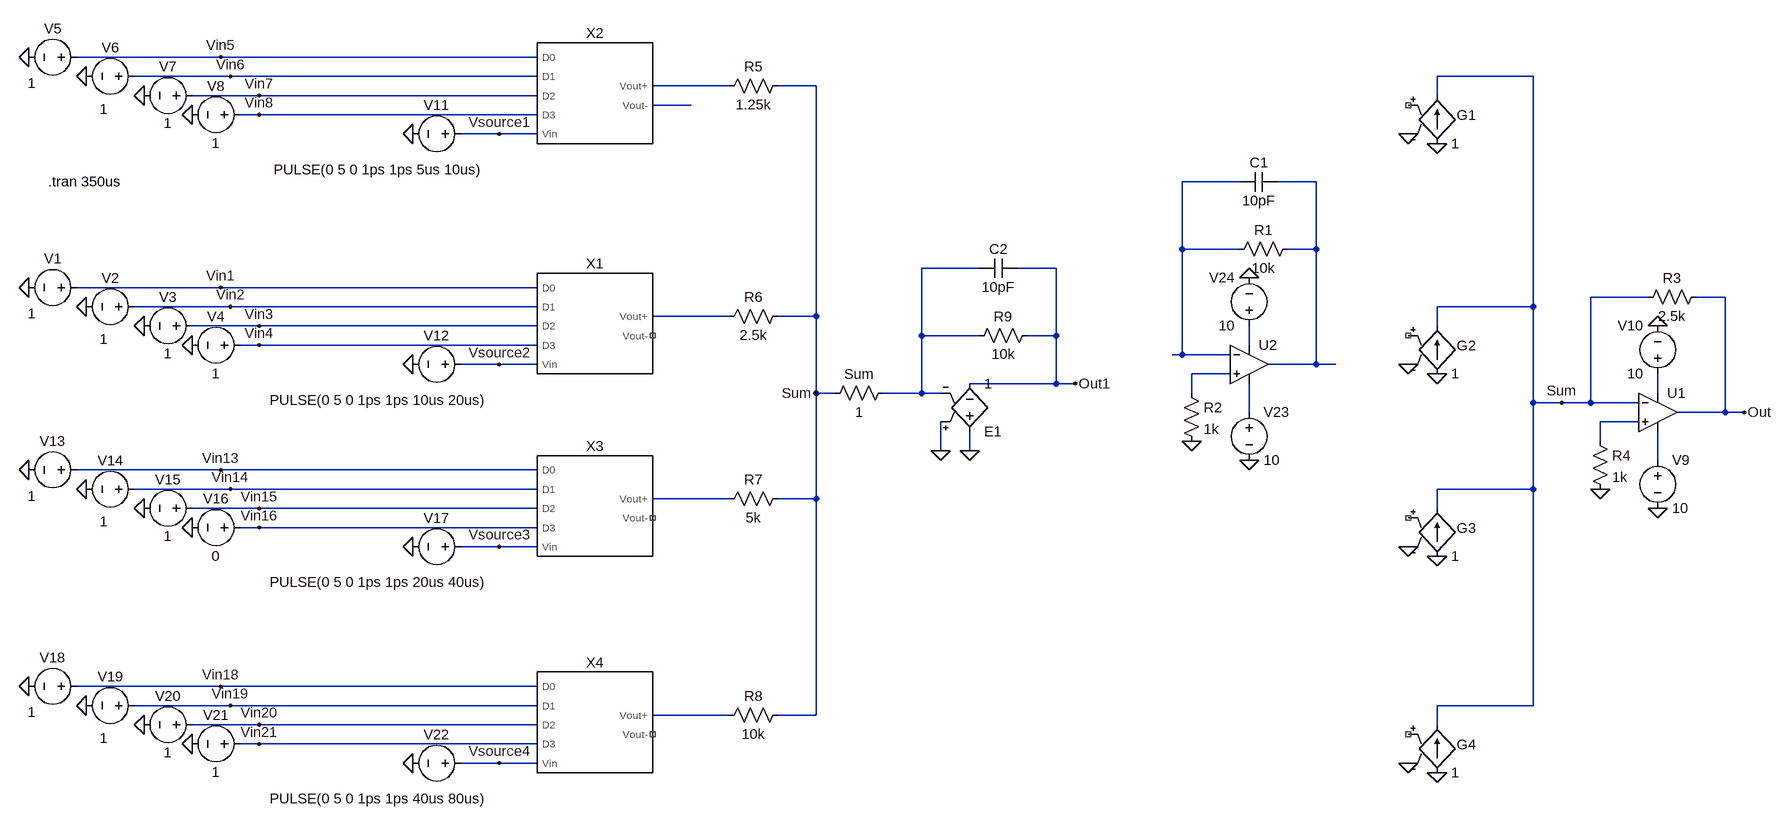
[diagram p0: schematic PerceptronV1.asc]
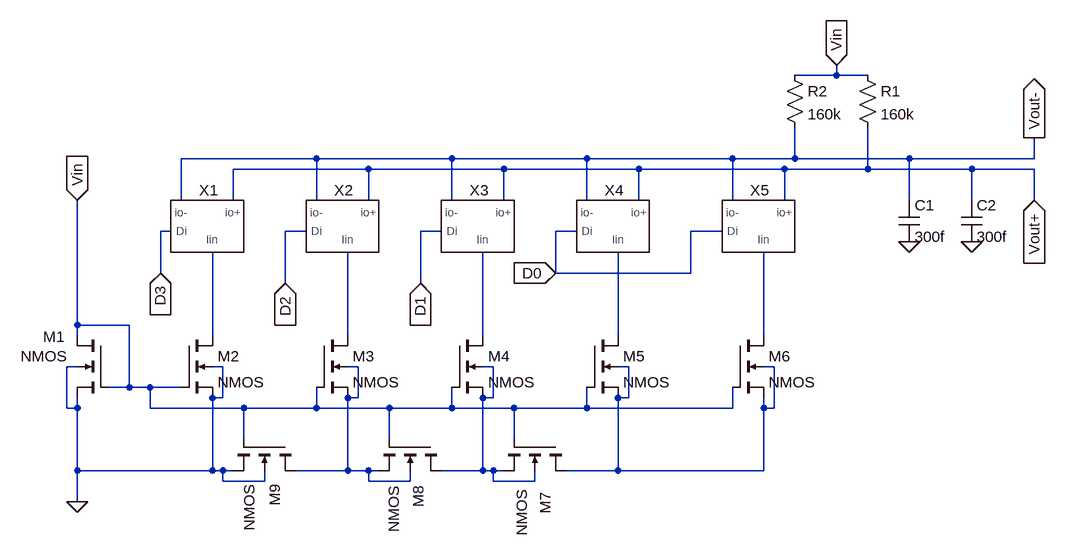
[diagram p1: sub-circuit 4_bit_dacv1.asc]
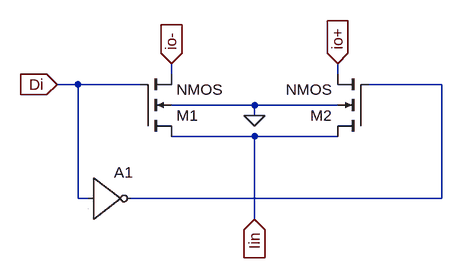
[diagram p2: sub-circuit differentialinput.asc]
PerceptronV1.asc, the LTspice schematic file:
Version 4
SHEET 1 3164 1116
WIRE -720 -160 -960 -160
WIRE -192 -160 -720 -160
WIRE -704 -128 -864 -128
WIRE -192 -128 -704 -128
WIRE 2752 -128 2592 -128
WIRE 128 -112 0 -112
WIRE 272 -112 208 -112
WIRE -656 -96 -768 -96
WIRE -192 -96 -656 -96
WIRE 2592 -96 2592 -128
WIRE 64 -80 0 -80
WIRE -656 -64 -688 -64
WIRE -192 -64 -656 -64
WIRE -256 -32 -320 -32
WIRE -192 -32 -256 -32
WIRE 1808 48 1712 48
WIRE 1936 48 1872 48
WIRE 1712 160 1712 48
WIRE 1808 160 1712 160
WIRE 1936 160 1936 48
WIRE 1936 160 1888 160
WIRE 544 192 448 192
WIRE 672 192 608 192
WIRE -720 224 -960 224
WIRE -192 224 -720 224
WIRE 2944 240 2848 240
WIRE 3072 240 3024 240
WIRE -704 256 -864 256
WIRE -192 256 -704 256
WIRE 2752 256 2752 -128
WIRE 2752 256 2592 256
WIRE 128 272 0 272
WIRE 272 272 272 -112
WIRE 272 272 208 272
WIRE -656 288 -768 288
WIRE -192 288 -656 288
WIRE 2592 288 2592 256
WIRE 448 304 448 192
WIRE 544 304 448 304
WIRE 672 304 672 192
WIRE 672 304 624 304
WIRE -656 320 -688 320
WIRE -192 320 -656 320
WIRE 1824 320 1824 288
WIRE 1712 336 1712 160
WIRE 1712 336 1696 336
WIRE 1792 336 1712 336
WIRE -256 352 -320 352
WIRE -192 352 -256 352
WIRE 1936 352 1936 160
WIRE 1936 352 1856 352
WIRE 1968 352 1936 352
WIRE 1792 368 1728 368
WIRE 672 384 672 304
WIRE 672 384 528 384
WIRE 704 384 672 384
WIRE 272 400 272 272
WIRE 304 400 272 400
WIRE 448 400 448 304
WIRE 448 400 384 400
WIRE 480 400 448 400
WIRE 1728 400 1728 368
WIRE 2960 400 2960 368
WIRE 2752 416 2752 256
WIRE 2800 416 2752 416
WIRE 2848 416 2848 240
WIRE 2848 416 2800 416
WIRE 2928 416 2848 416
WIRE 1824 432 1824 384
WIRE 3072 432 3072 240
WIRE 3072 432 2992 432
WIRE 3104 432 3072 432
WIRE 2928 448 2864 448
WIRE 2864 480 2864 448
WIRE 480 496 480 448
WIRE 528 496 528 464
WIRE 2960 512 2960 464
WIRE -720 528 -960 528
WIRE -192 528 -720 528
WIRE -704 560 -864 560
WIRE -192 560 -704 560
WIRE 2752 560 2752 416
WIRE 2752 560 2592 560
WIRE 128 576 0 576
WIRE 272 576 272 400
WIRE 272 576 208 576
WIRE -656 592 -768 592
WIRE -192 592 -656 592
WIRE 2592 592 2592 560
WIRE -656 624 -688 624
WIRE -192 624 -656 624
WIRE -256 656 -320 656
WIRE -192 656 -256 656
WIRE -720 912 -960 912
WIRE -192 912 -720 912
WIRE -704 944 -864 944
WIRE -192 944 -704 944
WIRE 2752 944 2752 560
WIRE 2752 944 2592 944
WIRE 128 960 0 960
WIRE 272 960 272 576
WIRE 272 960 208 960
WIRE -656 976 -768 976
WIRE -192 976 -656 976
WIRE 2592 976 2592 944
WIRE -656 1008 -688 1008
WIRE -192 1008 -656 1008
WIRE -256 1040 -320 1040
WIRE -192 1040 -256 1040
FLAG 2592 -16 0
FLAG 2544 -32 0
FLAG 2960 592 0
FLAG 2960 288 0
FLAG 2864 560 0
FLAG 2800 416 Sum
FLAG 3104 432 Out
FLAG -768 -64 0
FLAG -848 -96 0
FLAG -944 -128 0
FLAG -1040 -160 0
FLAG -720 -160 Vin5
FLAG -704 -128 Vin6
FLAG -656 -96 Vin7
FLAG -656 -64 Vin8
FLAG -400 -32 0
FLAG 2592 368 0
FLAG 2544 352 0
FLAG -768 320 0
FLAG -848 288 0
FLAG -944 256 0
FLAG -1040 224 0
FLAG -720 224 Vin1
FLAG -704 256 Vin2
FLAG -656 288 Vin3
FLAG -656 320 Vin4
FLAG -400 352 0
FLAG 2592 672 0
FLAG 2544 656 0
FLAG -768 624 0
FLAG -848 592 0
FLAG -944 560 0
FLAG -1040 528 0
FLAG -720 528 Vin13
FLAG -704 560 Vin14
FLAG -656 592 Vin15
FLAG -656 624 Vin16
FLAG -400 656 0
FLAG 2592 1056 0
FLAG 2544 1040 0
FLAG -768 1008 0
FLAG -848 976 0
FLAG -944 944 0
FLAG -1040 912 0
FLAG -720 912 Vin18
FLAG -704 944 Vin19
FLAG -656 976 Vin20
FLAG -656 1008 Vin21
FLAG -400 1040 0
FLAG 1824 512 0
FLAG 1824 208 0
FLAG 1728 480 0
FLAG 272 400 Sum
FLAG 704 384 Out1
FLAG -256 656 Vsource3
FLAG -256 -32 Vsource1
FLAG -256 352 Vsource2
FLAG -256 1040 Vsource4
FLAG 480 496 0
FLAG 528 496 0
SYMBOL g 2592 -112 R0
WINDOW 0 33 49 Left 2
SYMATTR InstName G1
SYMATTR Value 1
SYMBOL res 2928 256 R270
WINDOW 0 32 56 VTop 2
WINDOW 3 0 56 VBottom 2
SYMATTR InstName R3
SYMATTR Value 2.5k
SYMBOL voltage 2960 496 R0
WINDOW 123 0 0 Left 0
WINDOW 39 0 0 Left 0
SYMATTR InstName V9
SYMATTR Value 10
SYMBOL voltage 2960 384 R180
WINDOW 0 24 96 Left 2
WINDOW 3 24 16 Left 2
WINDOW 123 0 0 Left 0
WINDOW 39 0 0 Left 0
SYMATTR InstName V10
SYMATTR Value 10
SYMBOL res 2848 464 R0
SYMATTR InstName R4
SYMATTR Value 1k
SYMBOL OpAmps\\UniversalOpAmp 2960 432 R0
SYMATTR InstName U1
SYMBOL 4_Bit_DACV1 -96 -80 R0
SYMATTR InstName X2
SYMBOL voltage -944 -160 R90
WINDOW 0 -32 56 VBottom 2
WINDOW 3 28 91 VTop 2
WINDOW 123 0 0 Left 0
WINDOW 39 0 0 Left 0
SYMATTR InstName V5
SYMATTR Value 1
SYMBOL voltage -848 -128 R90
WINDOW 0 -32 56 VBottom 2
WINDOW 3 39 67 VTop 2
WINDOW 123 0 0 Left 0
WINDOW 39 0 0 Left 0
SYMATTR InstName V6
SYMATTR Value 1
SYMBOL voltage -752 -96 R90
WINDOW 0 -32 56 VBottom 2
WINDOW 3 62 56 VBottom 2
WINDOW 123 0 0 Left 0
WINDOW 39 0 0 Left 0
SYMATTR InstName V7
SYMATTR Value 1
SYMBOL voltage -672 -64 R90
WINDOW 0 -32 56 VBottom 2
WINDOW 3 32 56 VTop 2
WINDOW 123 0 0 Left 0
WINDOW 39 0 0 Left 0
SYMATTR InstName V8
SYMATTR Value 1
SYMBOL voltage -304 -32 R90
WINDOW 0 -32 56 VBottom 2
WINDOW 3 44 155 VTop 2
WINDOW 123 0 0 Left 0
WINDOW 39 0 0 Left 0
SYMATTR InstName V11
SYMATTR Value PULSE(0 5 0 1ps 1ps 5us 10us)
SYMBOL g 2592 272 R0
WINDOW 0 33 49 Left 2
SYMATTR InstName G2
SYMATTR Value 1
SYMBOL 4_Bit_DACV1 -96 304 R0
SYMATTR InstName X1
SYMBOL voltage -944 224 R90
WINDOW 0 -32 56 VBottom 2
WINDOW 3 28 91 VTop 2
WINDOW 123 0 0 Left 0
WINDOW 39 0 0 Left 0
SYMATTR InstName V1
SYMATTR Value 1
SYMBOL voltage -848 256 R90
WINDOW 0 -32 56 VBottom 2
WINDOW 3 39 67 VTop 2
WINDOW 123 0 0 Left 0
WINDOW 39 0 0 Left 0
SYMATTR InstName V2
SYMATTR Value 1
SYMBOL voltage -752 288 R90
WINDOW 0 -32 56 VBottom 2
WINDOW 3 62 56 VBottom 2
WINDOW 123 0 0 Left 0
WINDOW 39 0 0 Left 0
SYMATTR InstName V3
SYMATTR Value 1
SYMBOL voltage -672 320 R90
WINDOW 0 -32 56 VBottom 2
WINDOW 3 32 56 VTop 2
WINDOW 123 0 0 Left 0
WINDOW 39 0 0 Left 0
SYMATTR InstName V4
SYMATTR Value 1
SYMBOL voltage -304 352 R90
WINDOW 0 -32 56 VBottom 2
WINDOW 3 44 155 VTop 2
WINDOW 123 0 0 Left 0
WINDOW 39 0 0 Left 0
SYMATTR InstName V12
SYMATTR Value PULSE(0 5 0 1ps 1ps 10us 20us)
SYMBOL g 2592 576 R0
WINDOW 0 33 49 Left 2
SYMATTR InstName G3
SYMATTR Value 1
SYMBOL 4_Bit_DACV1 -96 608 R0
SYMATTR InstName X3
SYMBOL voltage -944 528 R90
WINDOW 0 -32 56 VBottom 2
WINDOW 3 28 91 VTop 2
WINDOW 123 0 0 Left 0
WINDOW 39 0 0 Left 0
SYMATTR InstName V13
SYMATTR Value 1
SYMBOL voltage -848 560 R90
WINDOW 0 -32 56 VBottom 2
WINDOW 3 39 67 VTop 2
WINDOW 123 0 0 Left 0
WINDOW 39 0 0 Left 0
SYMATTR InstName V14
SYMATTR Value 1
SYMBOL voltage -752 592 R90
WINDOW 0 -32 56 VBottom 2
WINDOW 3 62 56 VBottom 2
WINDOW 123 0 0 Left 0
WINDOW 39 0 0 Left 0
SYMATTR InstName V15
SYMATTR Value 1
SYMBOL voltage -672 624 R90
WINDOW 0 -32 56 VBottom 2
WINDOW 3 32 56 VTop 2
WINDOW 123 0 0 Left 0
WINDOW 39 0 0 Left 0
SYMATTR InstName V16
SYMATTR Value 0
SYMBOL voltage -304 656 R90
WINDOW 0 -32 56 VBottom 2
WINDOW 3 44 155 VTop 2
WINDOW 123 0 0 Left 0
WINDOW 39 0 0 Left 0
SYMATTR InstName V17
SYMATTR Value PULSE(0 5 0 1ps 1ps 20us 40us)
SYMBOL g 2592 960 R0
WINDOW 0 33 49 Left 2
SYMATTR InstName G4
SYMATTR Value 1
SYMBOL 4_Bit_DACV1 -96 992 R0
SYMATTR InstName X4
SYMBOL voltage -944 912 R90
WINDOW 0 -32 56 VBottom 2
WINDOW 3 28 91 VTop 2
WINDOW 123 0 0 Left 0
WINDOW 39 0 0 Left 0
SYMATTR InstName V18
SYMATTR Value 1
SYMBOL voltage -848 944 R90
WINDOW 0 -32 56 VBottom 2
WINDOW 3 39 67 VTop 2
WINDOW 123 0 0 Left 0
WINDOW 39 0 0 Left 0
SYMATTR InstName V19
SYMATTR Value 1
SYMBOL voltage -752 976 R90
WINDOW 0 -32 56 VBottom 2
WINDOW 3 62 56 VBottom 2
WINDOW 123 0 0 Left 0
WINDOW 39 0 0 Left 0
SYMATTR InstName V20
SYMATTR Value 1
SYMBOL voltage -672 1008 R90
WINDOW 0 -32 56 VBottom 2
WINDOW 3 32 56 VTop 2
WINDOW 123 0 0 Left 0
WINDOW 39 0 0 Left 0
SYMATTR InstName V21
SYMATTR Value 1
SYMBOL voltage -304 1040 R90
WINDOW 0 -32 56 VBottom 2
WINDOW 3 44 155 VTop 2
WINDOW 123 0 0 Left 0
WINDOW 39 0 0 Left 0
SYMATTR InstName V22
SYMATTR Value PULSE(0 5 0 1ps 1ps 40us 80us)
SYMBOL res 1792 176 R270
WINDOW 0 32 56 VTop 2
WINDOW 3 0 56 VBottom 2
SYMATTR InstName R1
SYMATTR Value 10k
SYMBOL voltage 1824 416 R0
WINDOW 123 0 0 Left 0
WINDOW 39 0 0 Left 0
SYMATTR InstName V23
SYMATTR Value 10
SYMBOL voltage 1824 304 R180
WINDOW 0 24 96 Left 2
WINDOW 3 24 16 Left 2
WINDOW 123 0 0 Left 0
WINDOW 39 0 0 Left 0
SYMATTR InstName V24
SYMATTR Value 10
SYMBOL res 1712 384 R0
SYMATTR InstName R2
SYMATTR Value 1k
SYMBOL OpAmps\\UniversalOpAmp 1824 352 R0
SYMATTR InstName U2
SYMBOL cap 1872 32 R90
WINDOW 0 0 32 VBottom 2
WINDOW 3 32 32 VTop 2
SYMATTR InstName C1
SYMATTR Value 10pF
SYMBOL res 224 -128 R90
WINDOW 0 0 56 VBottom 2
WINDOW 3 32 56 VTop 2
SYMATTR InstName R5
SYMATTR Value 1.25k
SYMBOL res 224 256 R90
WINDOW 0 0 56 VBottom 2
WINDOW 3 32 56 VTop 2
SYMATTR InstName R6
SYMATTR Value 2.5k
SYMBOL res 224 560 R90
WINDOW 0 0 56 VBottom 2
WINDOW 3 32 56 VTop 2
SYMATTR InstName R7
SYMATTR Value 5k
SYMBOL res 224 944 R90
WINDOW 0 0 56 VBottom 2
WINDOW 3 32 56 VTop 2
SYMATTR InstName R8
SYMATTR Value 10k
SYMBOL res 288 416 R270
WINDOW 0 32 56 VTop 2
WINDOW 3 0 56 VBottom 2
SYMATTR InstName Sum
SYMATTR Value 1
SYMBOL e 528 480 M180
SYMATTR InstName E1
SYMATTR Value 1
SYMBOL res 528 320 R270
WINDOW 0 32 56 VTop 2
WINDOW 3 0 56 VBottom 2
SYMATTR InstName R9
SYMATTR Value 10k
SYMBOL cap 608 176 R90
WINDOW 0 0 32 VBottom 2
WINDOW 3 32 32 VTop 2
SYMATTR InstName C2
SYMATTR Value 10pF
TEXT -1008 48 Left 2 !.tran 350us

4_bit_dacv1.asc, the sub-circuit schematic file:
Version 4
SHEET 1 1652 696
WIRE 1216 -80 1216 -96
WIRE 1216 -80 1152 -80
WIRE 1264 -80 1216 -80
WIRE 416 48 208 48
WIRE 624 48 416 48
WIRE 832 48 624 48
WIRE 1056 48 832 48
WIRE 1152 48 1152 0
WIRE 1152 48 1056 48
WIRE 1328 48 1152 48
WIRE 1520 48 1520 16
WIRE 1520 48 1328 48
WIRE 496 64 288 64
WIRE 704 64 496 64
WIRE 912 64 704 64
WIRE 1136 64 912 64
WIRE 1264 64 1264 0
WIRE 1264 64 1136 64
WIRE 1424 64 1264 64
WIRE 1520 64 1424 64
WIRE 208 112 208 48
WIRE 288 112 288 64
WIRE 416 112 416 48
WIRE 496 112 496 64
WIRE 624 112 624 48
WIRE 704 112 704 64
WIRE 832 112 832 48
WIRE 912 112 912 64
WIRE 1056 112 1056 48
WIRE 1136 112 1136 64
WIRE 1328 112 1328 48
WIRE 1424 112 1424 64
WIRE 1520 112 1520 64
WIRE 192 160 176 160
WIRE 400 160 368 160
WIRE 608 160 576 160
WIRE 816 160 784 160
WIRE 1040 160 992 160
WIRE 176 224 176 160
WIRE 784 224 784 160
WIRE 992 224 992 160
WIRE 992 224 784 224
WIRE 368 240 368 160
WIRE 576 240 576 160
WIRE 48 304 48 112
WIRE 128 304 48 304
WIRE 48 320 48 304
WIRE 256 320 256 192
WIRE 464 320 464 192
WIRE 672 320 672 192
WIRE 880 320 880 192
WIRE 1104 320 1104 192
WIRE 48 368 32 368
WIRE 272 368 256 368
WIRE 480 368 464 368
WIRE 688 368 672 368
WIRE 896 368 880 368
WIRE 1120 368 1104 368
WIRE 128 400 128 304
WIRE 128 400 96 400
WIRE 160 400 128 400
WIRE 208 400 160 400
WIRE 272 416 272 368
WIRE 272 416 256 416
WIRE 480 416 480 368
WIRE 480 416 464 416
WIRE 688 416 688 368
WIRE 688 416 672 416
WIRE 896 416 896 368
WIRE 896 416 880 416
WIRE 32 432 32 368
WIRE 48 432 48 416
WIRE 48 432 32 432
WIRE 160 432 160 400
WIRE 304 432 160 432
WIRE 416 432 416 400
WIRE 416 432 304 432
WIRE 528 432 416 432
WIRE 624 432 624 400
WIRE 624 432 528 432
WIRE 720 432 624 432
WIRE 832 432 832 400
WIRE 832 432 720 432
WIRE 1056 432 1056 400
WIRE 1056 432 832 432
WIRE 1104 432 1104 416
WIRE 1120 432 1120 368
WIRE 1120 432 1104 432
WIRE 304 480 304 432
WIRE 528 480 528 432
WIRE 720 480 720 432
WIRE 48 528 48 432
WIRE 256 528 256 416
WIRE 256 528 48 528
WIRE 272 528 256 528
WIRE 288 528 272 528
WIRE 464 528 464 416
WIRE 464 528 384 528
WIRE 496 528 464 528
WIRE 512 528 496 528
WIRE 672 528 672 416
WIRE 672 528 608 528
WIRE 688 528 672 528
WIRE 704 528 688 528
WIRE 880 528 880 416
WIRE 880 528 800 528
WIRE 1104 528 1104 432
WIRE 1104 528 880 528
WIRE 272 544 272 528
WIRE 336 544 336 528
WIRE 336 544 272 544
WIRE 496 544 496 528
WIRE 560 544 560 528
WIRE 560 544 496 544
WIRE 688 544 688 528
WIRE 752 544 752 528
WIRE 752 544 688 544
WIRE 48 576 48 528
FLAG 784 224 D0
IOPIN 784 224 In
FLAG 576 240 D1
IOPIN 576 240 In
FLAG 368 240 D2
IOPIN 368 240 In
FLAG 176 224 D3
IOPIN 176 224 In
FLAG 1328 176 0
FLAG 1424 176 0
FLAG 1520 16 Vout-
IOPIN 1520 16 Out
FLAG 1520 112 Vout+
IOPIN 1520 112 In
FLAG 48 576 0
FLAG 48 112 Vin
IOPIN 48 112 In
FLAG 1216 -96 Vin
IOPIN 1216 -96 In
SYMBOL nmos4 96 320 M0
WINDOW 0 67 2 Left 2
WINDOW 3 63 32 Left 2
SYMATTR InstName M1
SYMATTR Value2 l=45n w=250n
SYMBOL nmos4 208 320 R0
SYMATTR InstName M2
SYMATTR Value2 l=45n w=200n
SYMBOL nmos4 416 320 R0
SYMATTR InstName M3
SYMATTR Value2 l=45n w=350n
SYMBOL nmos4 624 320 R0
SYMATTR InstName M4
SYMATTR Value2 l=45n w=350n
SYMBOL nmos4 832 320 R0
SYMATTR InstName M5
SYMATTR Value2 l=45n w=350n
SYMBOL nmos4 1056 320 R0
SYMATTR InstName M6
SYMATTR Value2 l=45n w=350n
SYMBOL nmos4 800 480 R90
WINDOW 0 81 32 Left 2
WINDOW 3 77 68 Left 2
SYMATTR InstName M7
SYMATTR Value2 l=45n w=300n
SYMBOL nmos4 608 480 R90
WINDOW 0 71 35 Left 2
WINDOW 3 71 73 Left 2
SYMATTR InstName M8
SYMATTR Value2 l=45n w=300n
SYMBOL nmos4 384 480 R90
WINDOW 0 69 32 Left 2
WINDOW 3 69 71 Left 2
SYMATTR InstName M9
SYMATTR Value2 l=45n w=300n
SYMBOL DifferentialInput 224 176 R0
SYMATTR InstName X1
SYMBOL DifferentialInput 432 176 R0
SYMATTR InstName X2
SYMBOL DifferentialInput 640 176 R0
SYMATTR InstName X3
SYMBOL DifferentialInput 848 176 R0
SYMATTR InstName X4
SYMBOL DifferentialInput 1072 176 R0
SYMATTR InstName X5
SYMBOL cap 1312 112 R0
SYMATTR InstName C1
SYMATTR Value 300f
SYMBOL cap 1408 112 R0
SYMATTR InstName C2
SYMATTR Value 300f
SYMBOL res 1248 -96 R0
SYMATTR InstName R1
SYMATTR Value 160k
SYMBOL res 1136 -96 R0
SYMATTR InstName R2
SYMATTR Value 160k

differentialinput.asc, the sub-circuit schematic file:
Version 4
SHEET 1 880 680
WIRE 192 32 192 16
WIRE 448 32 448 16
WIRE 48 48 16 48
WIRE 144 48 48 48
WIRE 608 48 496 48
WIRE 320 80 192 80
WIRE 448 80 320 80
WIRE 320 96 320 80
WIRE 320 128 192 128
WIRE 448 128 320 128
WIRE 48 224 48 48
WIRE 64 224 48 224
WIRE 608 224 608 48
WIRE 608 224 128 224
WIRE 320 256 320 128
FLAG 320 96 0
FLAG 16 48 Di
IOPIN 16 48 In
FLAG 320 256 Iin
IOPIN 320 256 In
FLAG 192 16 io-
IOPIN 192 16 In
FLAG 448 16 io+
IOPIN 448 16 In
SYMBOL Digital\\inv 64 160 R0
SYMATTR InstName A1
SYMBOL nmos4 144 128 M180
SYMATTR InstName M1
SYMATTR Value2 l=45n w=120n
SYMBOL nmos4 496 128 R180
SYMATTR InstName M2
SYMATTR Value2 l=120n w=45n

The netlist it stands for:
* PerceptronV1.asc
G1 0 Sum NC_01 0 1
R3 Sum Out 2.5k
V9 N012 0 10
V10 N009 0 10
R4 N011 0 1k
XU1 N011 Sum N009 N012 Out level1 Avol=1Meg GBW=10Meg Vos=0 En=0 Enk=0 In=0 Ink=0 Rin=500Meg  ; pins In+ In- V+ V- OUT
XX2 Vin5 Vin6 Vin7 Vin8 Vsource1 N001 N002 4_bit_dacv1
V5 Vin5 0 1
V6 Vin6 0 1
V7 Vin7 0 1
V8 Vin8 0 1
V11 Vsource1 0 PULSE(0 5 0 1ps 1ps 5us 10us)
G2 0 Sum NC_02 0 1
XX1 Vin1 Vin2 Vin3 Vin4 Vsource2 N006 NC_03 4_bit_dacv1
V1 Vin1 0 1
V2 Vin2 0 1
V3 Vin3 0 1
V4 Vin4 0 1
V12 Vsource2 0 PULSE(0 5 0 1ps 1ps 10us 20us)
G3 0 Sum NC_04 0 1
XX3 Vin13 Vin14 Vin15 Vin16 Vsource3 N013 NC_05 4_bit_dacv1
V13 Vin13 0 1
V14 Vin14 0 1
V15 Vin15 0 1
V16 Vin16 0 0
V17 Vsource3 0 PULSE(0 5 0 1ps 1ps 20us 40us)
G4 0 Sum NC_06 0 1
XX4 Vin18 Vin19 Vin20 Vin21 Vsource4 N014 NC_07 4_bit_dacv1
V18 Vin18 0 1
V19 Vin19 0 1
V20 Vin20 0 1
V21 Vin21 0 1
V22 Vsource4 0 PULSE(0 5 0 1ps 1ps 40us 80us)
R1 N003 N004 10k
V23 N010 0 10
V24 N007 0 10
R2 N008 0 1k
XU2 N008 N003 N007 N010 N004 level1 Avol=1Meg GBW=10Meg Vos=0 En=0 Enk=0 In=0 Ink=0 Rin=500Meg  ; pins In+ In- V+ V- OUT
C1 N004 N003 10pF
R5 Sum N001 1.25k
R6 Sum N006 2.5k
R7 Sum N013 5k
R8 Sum N014 10k
R§Sum Sum N005 1
E1 0 Out1 0 N005 1
R9 N005 Out1 10k
C2 Out1 N005 10pF

* block symbol definitions
.subckt 4_bit_dacv1 D0 D1 D2 D3 Vin Vout+ Vout-
M1 Vin Vin 0 0 NMOS l=45n w=250n
M2 N001 Vin 0 0 NMOS l=45n w=200n
M3 N002 Vin N006 N006 NMOS l=45n w=350n
M4 N003 Vin N007 N007 NMOS l=45n w=350n
M5 N004 Vin N008 N008 NMOS l=45n w=350n
M6 N005 Vin N008 N008 NMOS l=45n w=350n
M7 N008 Vin N007 N007 NMOS l=45n w=300n
M8 N007 Vin N006 N006 NMOS l=45n w=300n
M9 N006 Vin 0 0 NMOS l=45n w=300n
XX1 D3 N001 Vout+ Vout- differentialinput
XX2 D2 N002 Vout+ Vout- differentialinput
XX3 D1 N003 Vout+ Vout- differentialinput
XX4 D0 N004 Vout+ Vout- differentialinput
XX5 D0 N005 Vout+ Vout- differentialinput
C1 Vout- 0 300f
C2 Vout+ 0 300f
R1 Vin Vout+ 160k
R2 Vin Vout- 160k
.ends 4_bit_dacv1

.subckt differentialinput Di Iin io+ io-
A1 Di 0 0 0 0 N001 0 0 BUF
M1 Iin Di io- 0 NMOS l=45n w=120n
M2 Iin N001 io+ 0 NMOS l=120n w=45n
.ends differentialinput

.model NMOS NMOS
.model PMOS PMOS
.lib standard.mos
.tran 350us
.lib UniversalOpAmp1.lib
.backanno
.end